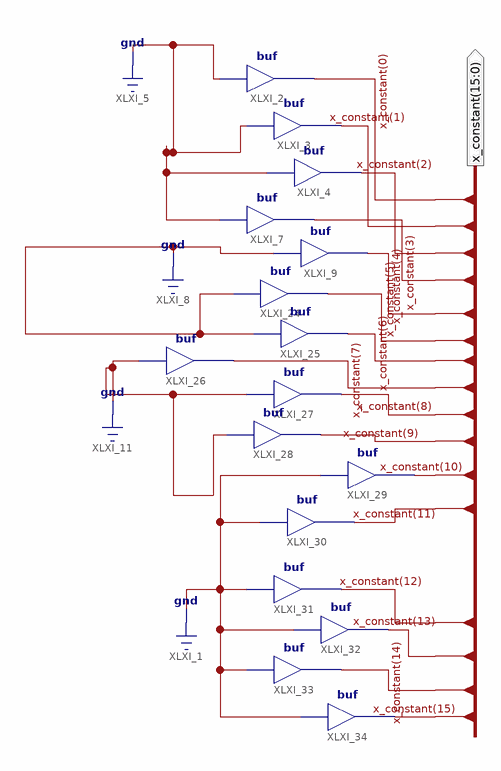
[diagram p0: schematic sheet 1]
// Xilinx ISE schematic gnd16bit.sch (spartan3) as structural Verilog: 16 symbols, 1 ports
module gnd16bit (
  output [15:0] x_constant
);

  buf XLXI_2 (x_constant[0], 1'b0);
  buf XLXI_3 (x_constant[1], 1'b0);
  buf XLXI_4 (x_constant[2], 1'b0);
  buf XLXI_7 (x_constant[3], 1'b0);
  buf XLXI_9 (x_constant[4], 1'b0);
  buf XLXI_24 (x_constant[5], 1'b0);
  buf XLXI_25 (x_constant[6], 1'b0);
  buf XLXI_26 (x_constant[7], 1'b0);
  buf XLXI_27 (x_constant[8], 1'b0);
  buf XLXI_28 (x_constant[9], 1'b0);
  buf XLXI_29 (x_constant[10], 1'b0);
  buf XLXI_30 (x_constant[11], 1'b0);
  buf XLXI_31 (x_constant[12], 1'b0);
  buf XLXI_32 (x_constant[13], 1'b0);
  buf XLXI_33 (x_constant[14], 1'b0);
  buf XLXI_34 (x_constant[15], 1'b0);
endmodule
